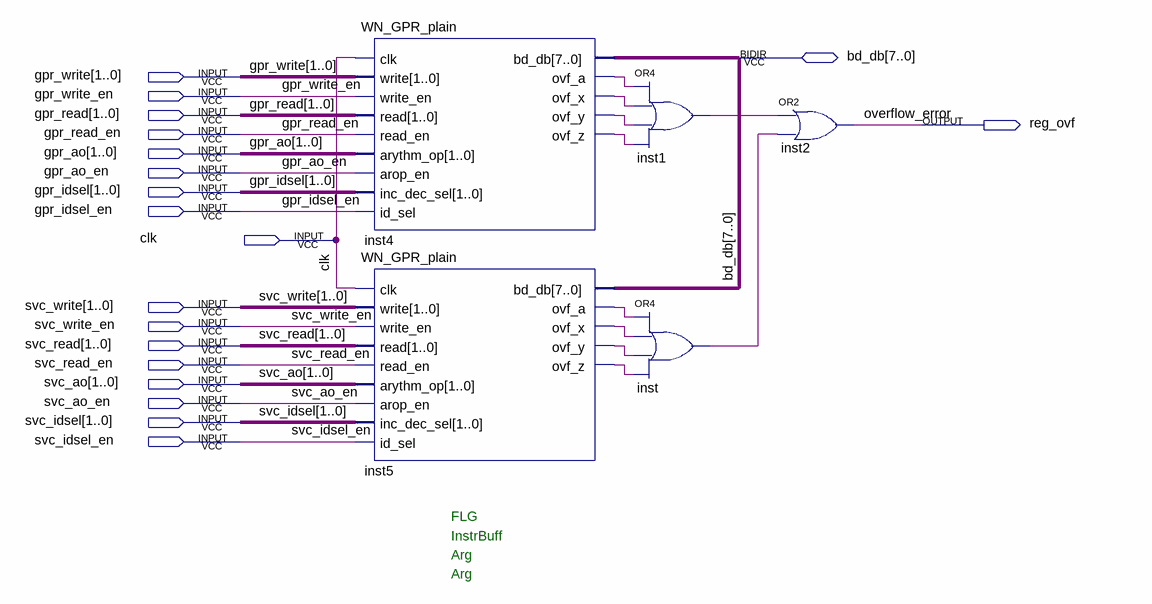
[diagram p0: schematic sheet]
// Quartus schematic WN_registers_assembly.bdf as structural Verilog: 5 symbols, 19 pins
module WN_registers_assembly (
  input  [1:0] gpr_write,
  input  gpr_write_en,
  input  [1:0] gpr_read,
  input  gpr_read_en,
  input  [1:0] gpr_ao,
  input  gpr_ao_en,
  input  [1:0] gpr_idsel,
  input  gpr_idsel_en,
  input  clk,
  input  [1:0] svc_write,
  input  svc_write_en,
  input  [1:0] svc_read,
  input  svc_read_en,
  input  [1:0] svc_ao,
  input  svc_ao_en,
  input  [1:0] svc_idsel,
  input  svc_idsel_en,
  inout  [7:0] bd_db,
  output reg_ovf
);

  wire inst1_out, inst4_ovf_a, inst4_ovf_x, inst4_ovf_y, inst4_ovf_z, inst5_ovf_a, inst5_ovf_x, inst5_ovf_y,
       inst5_ovf_z, inst_out;

  WN_GPR_plain inst4 (
    .clk(clk), .write(gpr_write), .write_en(gpr_write_en), .read(gpr_read), .read_en(gpr_read_en),
    .arythm_op(gpr_ao), .arop_en(gpr_ao_en), .inc_dec_sel(gpr_idsel), .id_sel(gpr_idsel_en),
    .ovf_a(inst4_ovf_a), .ovf_x(inst4_ovf_x), .ovf_y(inst4_ovf_y), .ovf_z(inst4_ovf_z), .bd_db(bd_db));
  WN_GPR_plain inst5 (
    .clk(clk), .write(svc_write), .write_en(svc_write_en), .read(svc_read), .read_en(svc_read_en),
    .arythm_op(svc_ao), .arop_en(svc_ao_en), .inc_dec_sel(svc_idsel), .id_sel(svc_idsel_en),
    .ovf_a(inst5_ovf_a), .ovf_x(inst5_ovf_x), .ovf_y(inst5_ovf_y), .ovf_z(inst5_ovf_z), .bd_db(bd_db));
  or inst1 (inst1_out, inst4_ovf_a, inst4_ovf_x, inst4_ovf_y, inst4_ovf_z);
  or inst (inst_out, inst5_ovf_a, inst5_ovf_x, inst5_ovf_y, inst5_ovf_z);
  or inst2 (reg_ovf, inst1_out, inst_out);

  // Other names for the same wires on the sheet: overflow_error = reg_ovf

  // Notes on the sheet:
  //   FLG
  //   InstrBuff
  //   Arg
  //   Arg
endmodule
